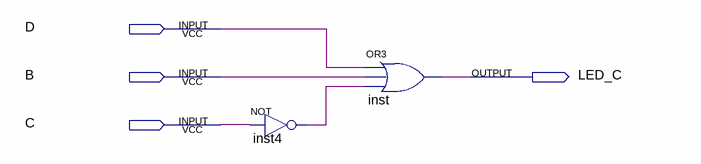
[diagram p0: schematic sheet]
// Quartus schematic led_c.bdf as structural Verilog: 2 symbols, 4 pins
module led_c (
  input  D,
  input  B,
  input  C,
  output LED_C
);

  wire inst4_out;

  not inst4 (inst4_out, C);
  or inst (LED_C, D, B, inst4_out);
endmodule
